# Altium schematic sheet MCU_CORE.SchDoc
size A4
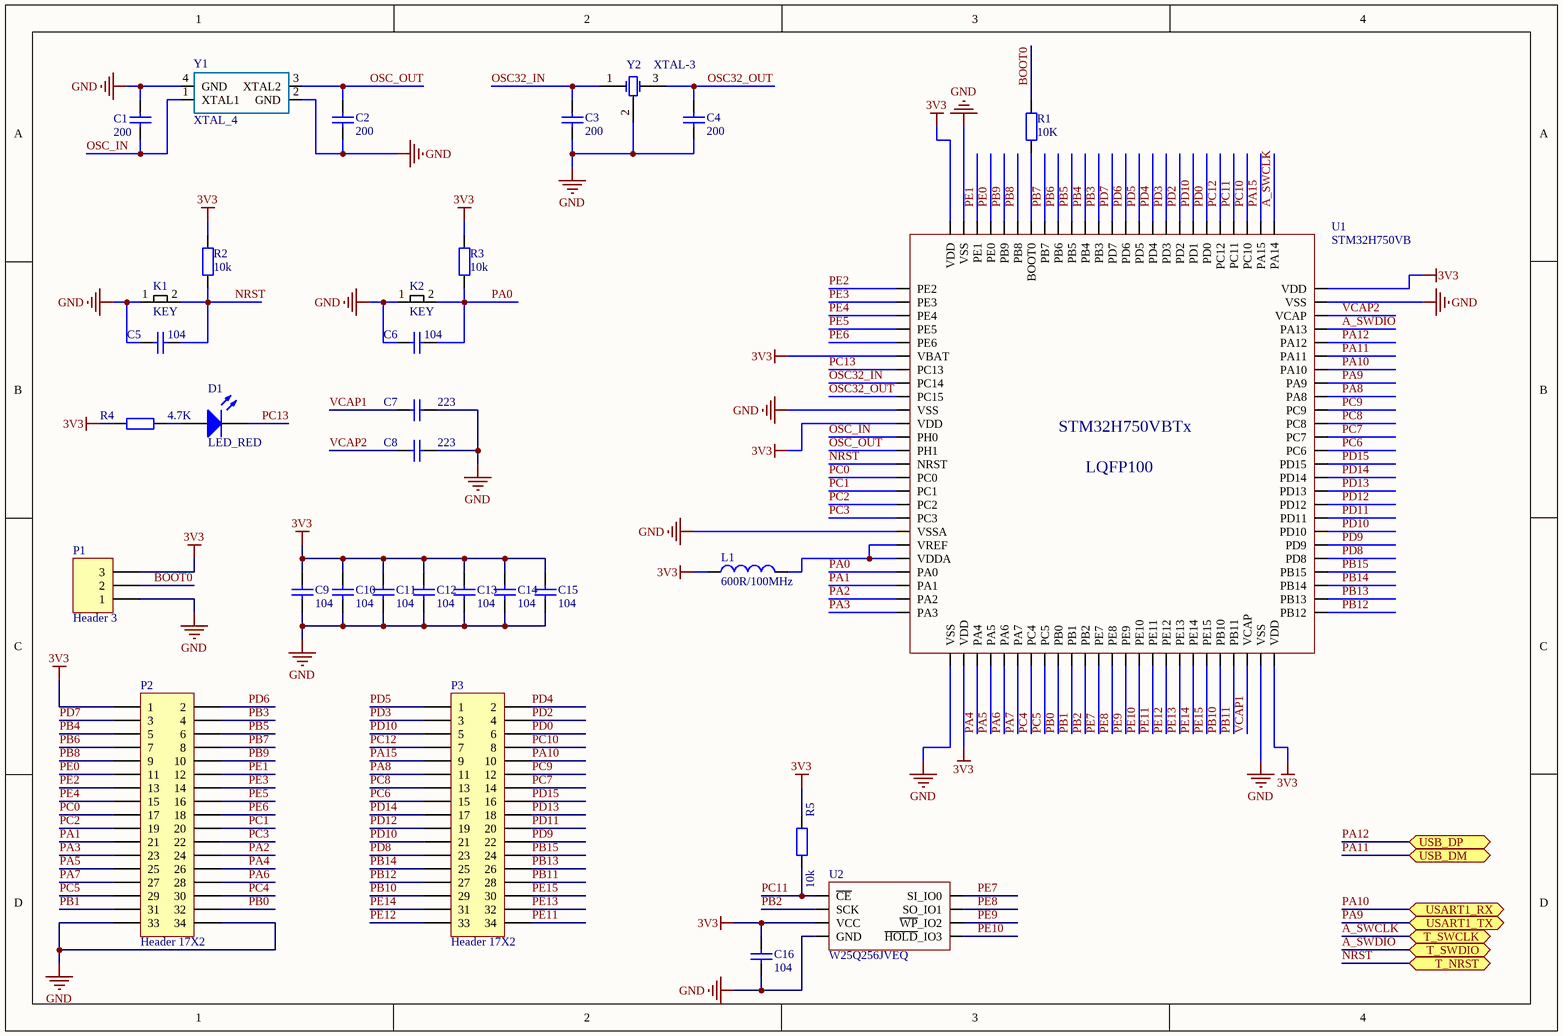
[diagram p0: MCU_CORE.SchDoc]

## Parts
C1  200  [C_SOP_0603]
C2  200  [C_SOP_0603]
C3  200  [C_SOP_0603]
C4  200  [C_SOP_0603]
C5  104  [C_SOP_0603]
C6  104  [C_SOP_0603]
C7  223  [C_SOP_0603]
C8  223  [C_SOP_0603]
C9  104  [C_SOP_0603]
C10  104  [C_SOP_0603]
C11  104  [C_SOP_0603]
C12  104  [C_SOP_0603]
C13  104  [C_SOP_0603]
C14  104  [C_SOP_0603]
C15  104  [C_SOP_0603]
C16  104  [C_SOP_0603]
D1  LED_RED  [LED_0603_R]
K1  KEY  [SW_PB_3X6]
K2  KEY  [SW_PB_3X6]
L1  600R/100MHz
P1  Header 3  [HDR1X3]
P2  Header 17X2  [HDR2X17]
P3  Header 17X2  [HDR2X17]
R1  10K  [R_SMD_0603]
R2  10k  [R_SMD_0603]
R3  10k  [R_SMD_0603]
R4  4.7K  [R_SMD_0603]
R5  10k  [R_SMD_0603]
U1  STM32H750VB  [LQFP_100_14X14]
U2  W25Q256JVEQ  [SOIC_8]
Y1  XTAL_4  [XTAL_SMD_3225]
Y2  XTAL-3  [XTAL_SMD_3215_2]

## Ports
T_NRST (bidir), T_SWCLK (bidir), T_SWDIO (bidir), USART1_RX (bidir), USART1_TX (bidir), USB_DM (bidir), USB_DP (bidir)

## Nets
3V3: C9.1 C10.1 C11.1 C12.1 C13.1 C14.1 C15.1 C16.1 L1.1 P1.3 P2.1 R2.2 R3.2 R4.2 R5.2 U1.6(VBAT) U1.11(VDD) U1.27(VDD) U1.50(VDD) U1.75(VDD) U1.100(VDD) U2.8(VCC)
GND: C1.2 C2.1 C3.1 C4.1 C5.2 C6.2 C7.1 C8.1 C9.2 C10.2 C11.2 C12.2 C13.2 C14.2 C15.2 C16.2 K1.1 K2.1 P1.1 P2.33 P2.34 U1.10(VSS) U1.19(VSSA) U1.26(VSS) U1.49(VSS) U1.74(VSS) U1.99(VSS) U2.4(GND) Y1.2(GND) Y1.4(GND) Y2.2(OSC2)
A_SWCLK: U1.76(PA14) ; port T_SWCLK
A_SWDIO: U1.72(PA13) ; port T_SWDIO
BOOT0: P1.2 R1.2
NRST: C5.1 K1.2 R2.1 U1.14(NRST) ; port T_NRST
OSC32_IN: C3.2 U1.8(PC14) Y2.1(OSC1)
OSC32_OUT: C4.2 U1.9(PC15) Y2.3(OSC2)
OSC_IN: C1.1 U1.12(PH0) Y1.1(XTAL1)
OSC_OUT: C2.2 U1.13(PH1) Y1.3(XTAL2)
PA0: C6.1 K2.2 R3.1 U1.22(PA0)
PA1: P2.21 U1.23(PA1)
PA2: P2.24 U1.24(PA2)
PA3: P2.23 U1.25(PA3)
PA4: P2.26 U1.28(PA4)
PA5: P2.25 U1.29(PA5)
PA6: P2.28 U1.30(PA6)
PA7: P2.27 U1.31(PA7)
PA8: P3.11 U1.67(PA8)
PA9: U1.68(PA9) ; port USART1_TX
PA10: P3.10 U1.69(PA10) ; port USART1_RX
PA11: U1.70(PA11) ; port USB_DM
PA12: U1.71(PA12) ; port USB_DP
PA15: P3.9 U1.77(PA15)
PB0: P2.32 U1.34(PB0)
PB1: P2.31 U1.35(PB1)
PB2: U1.36(PB2) U2.6(SCK)
PB3: P2.4 U1.89(PB3)
PB4: P2.5 U1.90(PB4)
PB5: P2.6 U1.91(PB5)
PB6: P2.7 U1.92(PB6)
PB7: P2.8 U1.93(PB7)
PB8: P2.9 U1.95(PB8)
PB9: P2.10 U1.96(PB9)
PB10: P3.29 U1.46(PB10)
PB11: P3.28 U1.47(PB11)
PB12: P3.27 U1.51(PB12)
PB13: P3.26 U1.52(PB13)
PB14: P3.25 U1.53(PB14)
PB15: P3.24 U1.54(PB15)
PC0: P2.17 U1.15(PC0)
PC1: P2.20 U1.16(PC1)
PC2: P2.19 U1.17(PC2)
PC3: P2.22 U1.18(PC3)
PC4: P2.30 U1.32(PC4)
PC5: P2.29 U1.33(PC5)
PC6: P3.15 U1.63(PC6)
PC7: P3.14 U1.64(PC7)
PC8: P3.13 U1.65(PC8)
PC9: P3.12 U1.66(PC9)
PC10: P3.8 U1.78(PC10)
PC11: R5.1 U1.79(PC11) U2.1(~{CE})
PC12: P3.7 U1.80(PC12)
PC13: D1.2(K) U1.7(PC13)
PD0: P3.6 U1.81(PD0)
PD2: P3.4 U1.83(PD2)
PD3: P3.3 U1.84(PD3)
PD4: P3.2 U1.85(PD4)
PD5: P3.1 U1.86(PD5)
PD6: P2.2 U1.87(PD6)
PD7: P2.3 U1.88(PD7)
PD8: P3.23 U1.55(PD8)
PD9: P3.22 U1.56(PD9)
PD10: P3.5 P3.21 U1.57(PD10) U1.82(PD1)
PD11: P3.20 U1.58(PD11)
PD12: P3.19 U1.59(PD12)
PD13: P3.18 U1.60(PD13)
PD14: P3.17 U1.61(PD14)
PD15: P3.16 U1.62(PD15)
PE0: P2.11 U1.97(PE0)
PE1: P2.12 U1.98(PE1)
PE2: P2.13 U1.1(PE2)
PE3: P2.14 U1.2(PE3)
PE4: P2.15 U1.3(PE4)
PE5: P2.16 U1.4(PE5)
PE6: P2.18 U1.5(PE6)
PE7: U1.37(PE7) U2.5(SI_IO0)
PE8: U1.38(PE8) U2.2(SO_IO1)
PE9: U1.39(PE9) U2.3(~{WP}_IO2)
PE10: U1.40(PE10) U2.7(~{HOLD}_IO3)
PE11: P3.34 U1.41(PE11)
PE12: P3.33 U1.42(PE12)
PE13: P3.32 U1.43(PE13)
PE14: P3.31 U1.44(PE14)
PE15: P3.30 U1.45(PE15)
VCAP1: C7.2 U1.48(VCAP)
VCAP2: C8.2 U1.73(VCAP)
NetD1_1: D1.1(A) R4.1
NetL1_2: L1.2 U1.20(VREF) U1.21(VDDA)
NetR1_1: R1.1 U1.94(BOOT0)

## Notes on the sheet
- (in symbol STM32H750VB) STM32H750VBTx; LQFP100

## Library data of the parts
C1-C16 = Cap
D1 = LED: 发光二极管
L1 = L
P1 = Header 3: Header, 3-Pin; LatestRevisionDate: 17-Jul-2002; LatestRevisionNote: Re-released for DXP Platform.; Publisher: Altium Limited
P2 P3 = Header 17X2: Header, 17-Pin, Dual row; LatestRevisionDate: 17-Jul-2002; LatestRevisionNote: Re-released for DXP Platform.; Publisher: Altium Limited
R1-R5 = Res
U1 = STM32H750VB: ST-MCU
U2 = W25Q256JVEQ: QSPI-FLASH